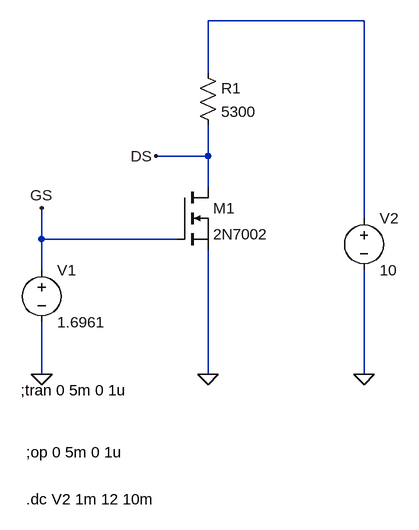
[diagram p0: schematic nds7002-sim.asc]
nds7002-sim.asc, the LTspice schematic file:
Version 4
SHEET 1 880 680
WIRE 400 -144 160 -144
WIRE 160 -64 160 -144
WIRE 160 64 160 16
WIRE 160 64 80 64
WIRE 160 112 160 64
WIRE 400 160 400 -144
WIRE -96 192 -96 144
WIRE 112 192 -96 192
WIRE -96 240 -96 192
WIRE -96 400 -96 320
WIRE 160 400 160 208
WIRE 400 400 400 240
FLAG 400 400 0
FLAG 160 400 0
FLAG -96 400 0
FLAG -96 144 GS
FLAG 80 64 DS
SYMBOL nmos 112 112 R0
SYMATTR InstName M1
SYMATTR Value 2N7002
SYMBOL voltage -96 224 R0
WINDOW 123 0 0 Left 0
WINDOW 39 0 0 Left 0
SYMATTR InstName V1
SYMATTR Value 1.6961
SYMBOL res 144 -80 R0
SYMATTR InstName R1
SYMATTR Value 5300
SYMBOL voltage 400 144 R0
WINDOW 123 0 0 Left 0
WINDOW 39 0 0 Left 0
SYMATTR InstName V2
SYMATTR Value 10
TEXT -128 424 Left 2 !;tran 0 5m 0 1u
TEXT -120 520 Left 2 !;op 0 5m 0 1u
TEXT -120 592 Left 2 !.dc V2 1m 12 10m

The netlist it stands for:
* nds7002-sim.asc
M1 DS GS 0 0 2N7002
V1 GS 0 1.6961
R1 N001 DS 5300
V2 N001 0 10
.model NMOS NMOS
.model PMOS PMOS
.lib standard.mos
;tran 0 5m 0 1u
;op 0 5m 0 1u
.dc V2 1m 12 10m
.backanno
.end